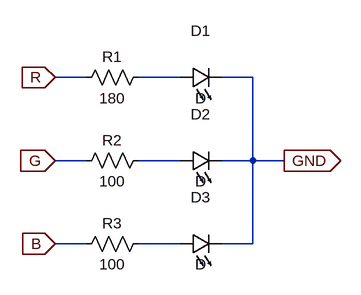
[diagram p0: schematic RGB-LED.asc]
RGB-LED.asc, the LTspice schematic file:
Version 4
SHEET 1 880 680
WIRE -80 80 -128 80
WIRE 64 80 0 80
WIRE 176 80 128 80
WIRE -80 208 -128 208
WIRE 64 208 0 208
WIRE 176 208 176 80
WIRE 176 208 128 208
WIRE 224 208 176 208
WIRE -80 336 -128 336
WIRE 64 336 0 336
WIRE 176 336 176 208
WIRE 176 336 128 336
FLAG -128 80 R
IOPIN -128 80 In
FLAG -128 208 G
IOPIN -128 208 In
FLAG -128 336 B
IOPIN -128 336 In
FLAG 224 208 GND
IOPIN 224 208 Out
SYMBOL LED 64 96 R270
WINDOW 0 72 32 VTop 2
WINDOW 3 0 32 VBottom 2
SYMATTR InstName D1
SYMBOL LED 64 224 R270
WINDOW 0 72 32 VTop 2
WINDOW 3 0 32 VBottom 2
SYMATTR InstName D2
SYMBOL LED 64 352 R270
WINDOW 0 72 32 VTop 2
WINDOW 3 0 32 VBottom 2
SYMATTR InstName D3
SYMBOL res 16 64 R90
WINDOW 0 0 56 VBottom 2
WINDOW 3 32 56 VTop 2
SYMATTR InstName R1
SYMATTR Value 180
SYMBOL res 16 192 R90
WINDOW 0 0 56 VBottom 2
WINDOW 3 32 56 VTop 2
SYMATTR InstName R2
SYMATTR Value 100
SYMBOL res 16 320 R90
WINDOW 0 0 56 VBottom 2
WINDOW 3 32 56 VTop 2
SYMATTR InstName R3
SYMATTR Value 100

The netlist it stands for:
* RGB-LED.asc
D1 N001 GND D
D2 N002 GND D
D3 N003 GND D
R1 N001 R 180
R2 N002 G 100
R3 N003 B 100
.model D D
.lib standard.dio
.backanno
.end